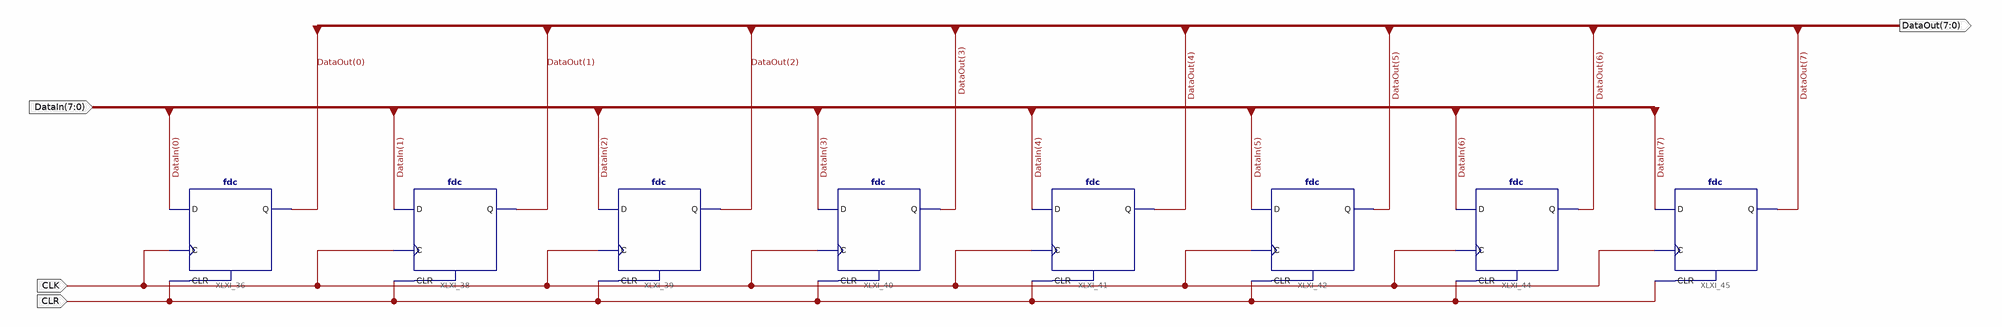
[diagram p0: schematic sheet 1]
// Xilinx ISE schematic RegPIPO_8.sch (spartan6) as structural Verilog: 8 symbols, 4 ports
module RegPIPO_8 (
  input  CLK,
  input  [7:0] DataIn,
  input  CLR,
  output [7:0] DataOut
);

  fdc XLXI_36 (.C(CLK), .CLR(CLR), .D(DataIn[0]), .Q(DataOut[0]));
  fdc XLXI_38 (.C(CLK), .CLR(CLR), .D(DataIn[1]), .Q(DataOut[1]));
  fdc XLXI_39 (.C(CLK), .CLR(CLR), .D(DataIn[2]), .Q(DataOut[2]));
  fdc XLXI_40 (.C(CLK), .CLR(CLR), .D(DataIn[3]), .Q(DataOut[3]));
  fdc XLXI_41 (.C(CLK), .CLR(CLR), .D(DataIn[4]), .Q(DataOut[4]));
  fdc XLXI_42 (.C(CLK), .CLR(CLR), .D(DataIn[5]), .Q(DataOut[5]));
  fdc XLXI_44 (.C(CLK), .CLR(CLR), .D(DataIn[6]), .Q(DataOut[6]));
  fdc XLXI_45 (.C(CLK), .CLR(CLR), .D(DataIn[7]), .Q(DataOut[7]));
endmodule
